# EAGLE design recep (EAGLE 5.11)
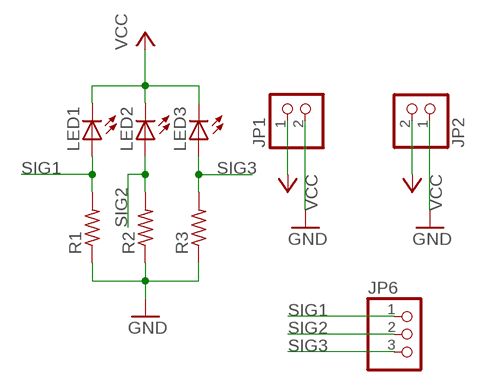
[diagram p0: schematic, sheet 1]

## Parts
JP1  PINHD-1X2/90  [1X02/90]
JP2  PINHD-1X2/90  [1X02/90]
JP6  PINHD-1X3  [1X03]
LED1  LED5MM  [LED5MM]
LED2  LED5MM  [LED5MM]
LED3  LED5MM  [LED5MM]
R1  R-US_0204/7  [0204/7]
R2  R-US_0204/7  [0204/7]
R3  R-US_0204/7  [0204/7]

## Nets
GND: JP1.2 JP2.1 R1.1 R2.1 R3.1
SIG1: JP6.1 LED1.A R1.2
SIG2: JP6.2 LED2.A R2.2
SIG3: JP6.3 LED3.A R3.2
VCC: JP1.1 JP2.2 LED1.K(C) LED2.K(C) LED3.K(C)

## Library data of the parts
JP1 JP2 = pinhead:PINHD-1X2: PIN HEADER
JP6 = pinhead:PINHD-1X3: PIN HEADER
LED1-LED3 = led:LED: LED OSRAM: - CHIPLED LG R971, LG N971, LY N971, LG Q971, LY Q971, LO R971, LY R971 LH N974, LH R974 LS Q976, LO Q976, LY Q976 LO Q996 - Hyper CHIPLED LW Q18S LB Q993, LB Q99A, LB R99A - SideLED LS A670, LO A670, LY A670, LG A670, LP A670 LB A673, LV A673, LT A673, LW A673 LH A674 LY A675 LS A676, LA A676, LO A676, LY A676, LW A676 LS A679, LY A679, LG A679 - Hyper Micro SIDELED® LS Y876, LA Y876, LO Y876, LY Y876 LT Y87S - SmartLED LW L88C, LW L88S LB L89C, LB L89S, LG L890 LS L89K, LO L89K, LY L89K LS L896, LA L896, LO L896, LY L896 - TOPLED LS T670, LO T670, LY T670, LG T670, LP T670 LSG T670, LSP T670, LSY T670, LOP T670, LYG T670 LG T671, LOG T671, LSG T671 LB T673, LV T673, LT T673, LW T673 LH T674 LS T676, LA T676, LO T676, LY T676, LB T676, LH T676, LSB T676, LW T676 LB T67C, LV T67C, LT T67C, LS T67K, LO T67K, LY T67K, LW E67C LS E67B, LA E67B, LO E67B, LY E67B, LB E67C, LV E67C, LT E67C LW T67C LS T679, LY T679, LG T679 LS T770, LO T770, LY T770, LG T770, LP T770 LB T773, LV T773, LT T773, LW T773 LH T774 LS E675, LA E675, LY E675, LS T675 LS T776, LA T776, LO T776, LY T776, LB T776 LHGB T686 LT T68C, LB T68C - Hyper Mini TOPLED® LB M676 - Mini TOPLED Santana® LG M470 LS M47K, LO M47K, LY M47K Source: http://www.osram.convergy.de LUXEON: - LUMILED® LXK2-PW12-R00, LXK2-PW12-S00, LXK2-PW14-U00, LXK2-PW14-V00 LXK2-PM12-R00, LXK2-PM12-S00, LXK2-PM14-U00 LXK2-PE12-Q00, LXK2-PE12-R00, LXK2-PE12-S00, LXK2-PE14-T00, LXK2-PE14-U00 LXK2-PB12-K00, LXK2-PB12-L00, LXK2-PB12-M00, LXK2-PB14-N00, LXK2-PB14-P00, LXK2-PB14-Q00 LXK2-PR12-L00, LXK2-PR12-M00, LXK2-PR14-Q00, LXK2-PR14-R00 LXK2-PD12-Q00, LXK2-PD12-R00, LXK2-PD12-S00 LXK2-PH12-R00, LXK2-PH12-S00 LXK2-PL12-P00, LXK2-PL12-Q00, LXK2-PL12-R00 Source: www.luxeon.com KINGBRIGHT: KA-3528ASYC Source: www.kingbright.com
R1-R3 = rcl:R-US_: RESISTOR, American symbol

## Board
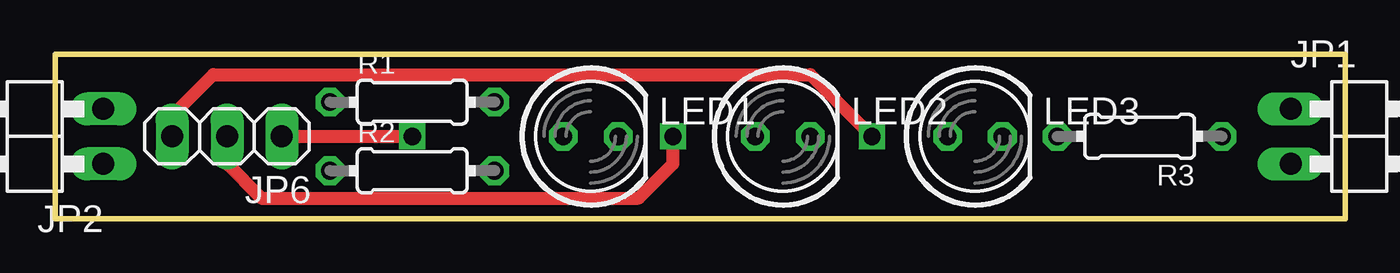
[diagram p1: board, top side]
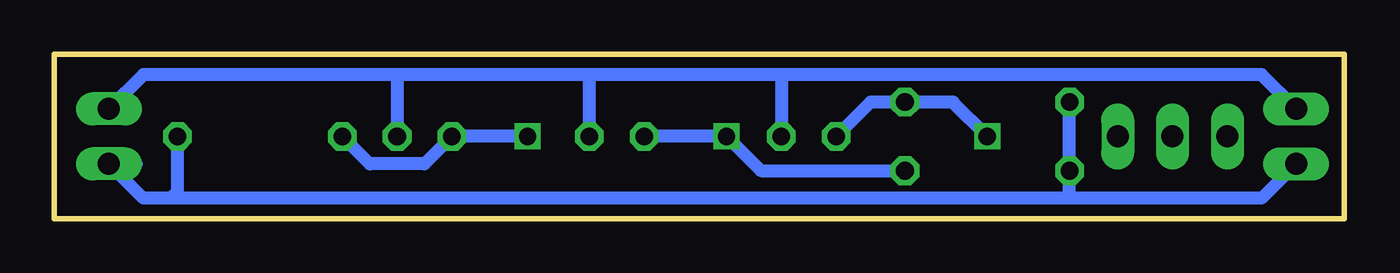
[diagram p2: board, bottom side, seen from below]

Size 59.69 x 7.62 mm. Coordinates in mm from the lower left corner, seen from the top.
Outline: 0,7.62 59.69,7.62 59.69,0 0,0 0,7.62
Copper layers (1*16): Top 0.035mm / dielectric 1.5mm / Bottom 0.035mm
Design rules "default *": minimum track width 10mil, minimum drill 24mil, track to track 8mil, track to pad 8mil, pad to pad 8mil, via to via 8mil, smd to smd 8mil, copper to edge 40mil, drill to drill 8mil, minimum pad ring 10mil, minimum via ring 8mil, stop-mask expansion 4mil, vias tented up to drill 0mil, thermal gap 10mil

### Footprints (pad centres in the part's own frame; a part is rotated, then mirrored left to right if it is on the bottom)
1X02/90 = drill 1.016 long: 1 -1.27,-3.81; 2 1.27,-3.81
1X03 = drill 1.016 long: 1 -2.54,0; 2 0,0; 3 2.54,0
LED5MM = drill 0.813 octagon: A -1.27,0; K 1.27,0
0204/7 = drill 0.813 octagon: 1 -3.81,0; 2 3.81,0

### Placement (x,y rotation side)
JP1  60.96,3.81 270 top
JP2  -1.59,3.81 90 top
JP6  7.94,3.81 180 top
LED1  24.77,3.81 0 top
LED2  33.66,3.81 0 top
LED3  42.55,3.81 0 top
R1  16.51,5.4 0 top
R2  16.51,2.22 0 top
R3  50.17,3.81 180 top

### Tracks (layer width: path | path; a pad name or v marks a point on that pad's centre or on a via)
GND
  Bottom 0.61: R1.1 R2.1 12.7,1.11 12.86,0.95 | 55.88,2.54 JP1.2 55.56,0.95 54.29,0.95 | JP2.1 3.81,0.95 12.86,0.95 | 12.86,0.95 54.29,0.95 | R3.1 53.98,1.27 54.29,0.95
SIG1  (via drill 0.8)
  Top 0.61: JP6.1 v16.51,3.81 | JP6.1
  Bottom 0.61: LED1.A 21.91,5.4 R1.2 18.1,5.4 v16.51,3.81
SIG2  (via drill 0.8)
  Top 0.61: JP6.2 7.94,2.54 9.53,0.95 26.99,0.95 28.57,2.54 v28.57,3.81
  Bottom 0.61: LED2.A | LED2.A v28.57,3.81 26.99,2.22 R2.2
SIG3  (via drill 0.8)
  Top 0.61: JP6.3 5.4,3.49 5.4,4.76 7.3,6.67 34.92,6.67 v37.78,3.81
  Bottom 0.61: R3.2 45.09,2.54 42.55,2.54 LED3.A v37.78,3.81
VCC
  Bottom 0.61: 43.81,6.67 55.56,6.67 JP1.1 | 34.92,6.67 43.81,6.67 | 26.04,6.67 34.92,6.67 | 26.04,6.67 LED1.K | 34.92,6.67 LED2.K | 43.81,6.67 LED3.K | 26.04,6.67 3.81,6.67 JP2.2